# Altium project PROC154E3_SCH.PrjPcb (part 34 of 60)

## Sheet 38. MCU GB ETHERNET.SchDoc: MCU GB ETHERNET
size 513 x 386 mm; Project: PROC154E2(001)_SK_AM69; Issue: 1.0; RevCode: E3; Page Create Date: March  8, 1995; Variant Name: Core Design; Schematic Page Number: 38; Page Number: 38; Page Size: C; Comment: MISTRAL_TITLEBLK_CSIZE_1; Page Count: 62; Schematic Page Count: 62; Name: PROC154E2 001 SK AM69; DsnPath: C:\Users\danie\Downloads\sprr466c\PROC154E3_RP\PROC154E3_SCH.DSN; SchematicName: SCHEMATIC1; PageName: 38. MCU GB ETHERNET; PageSize: C; TopSchematic: True
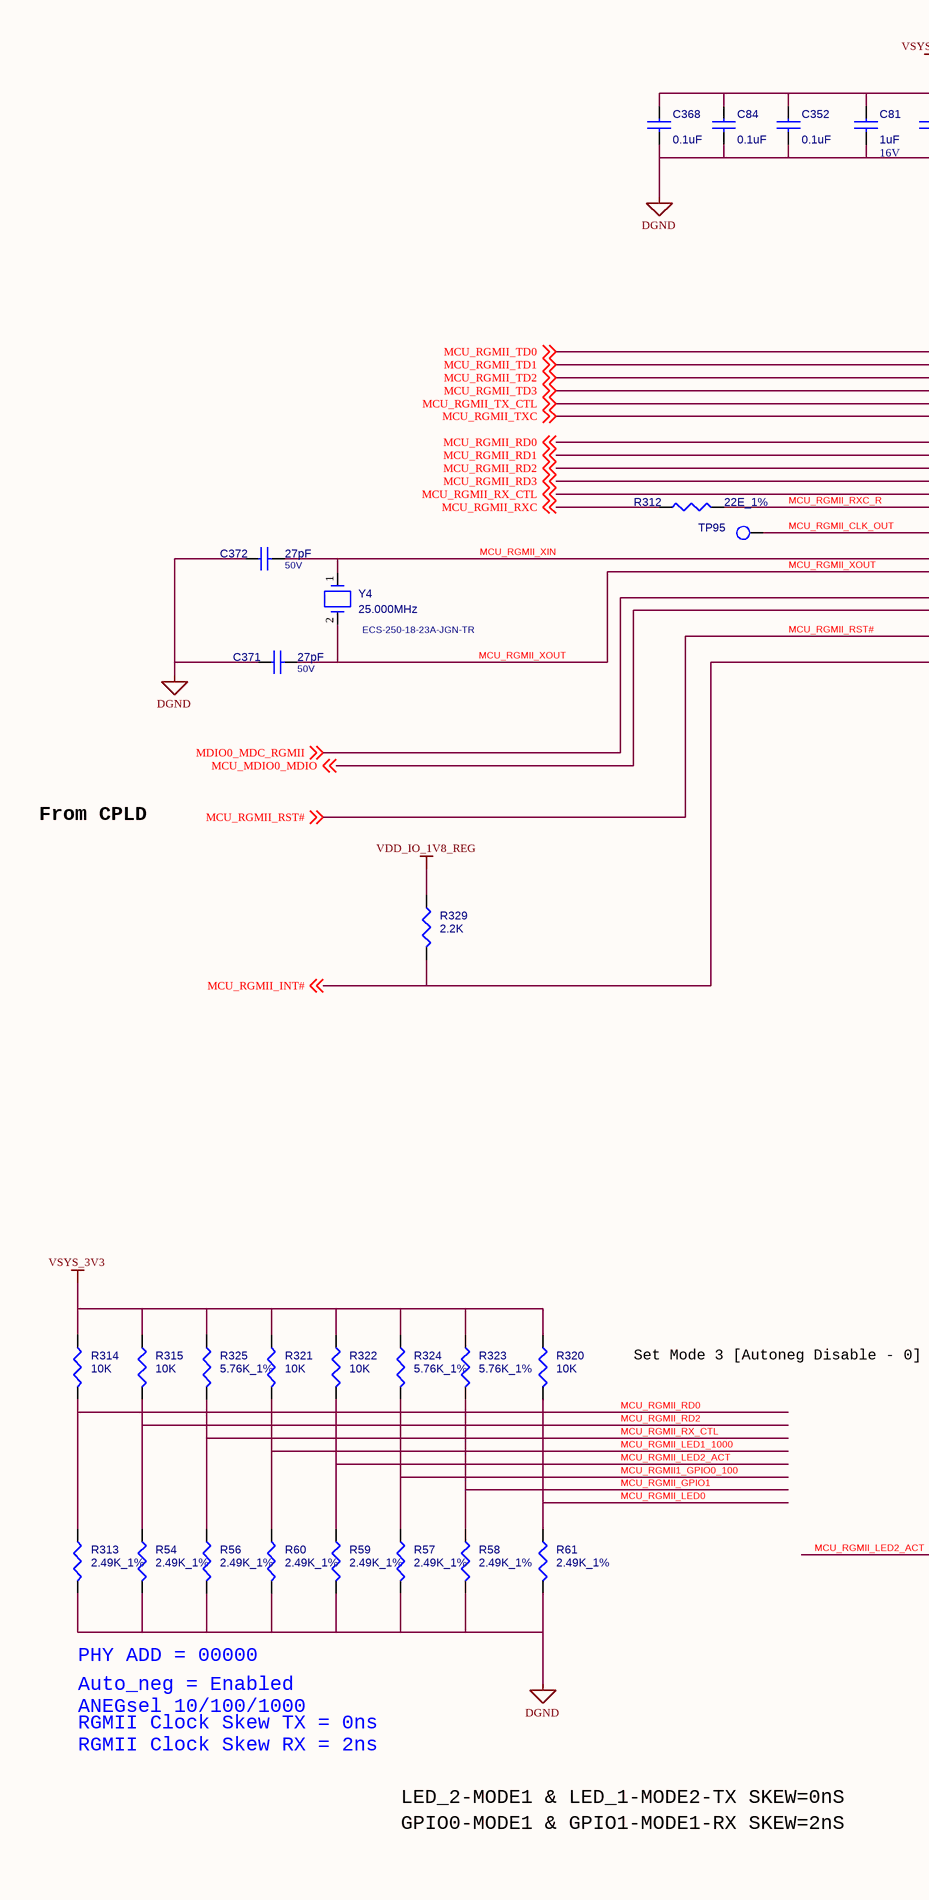
[diagram p62: 38. MCU GB ETHERNET.SchDoc, left]
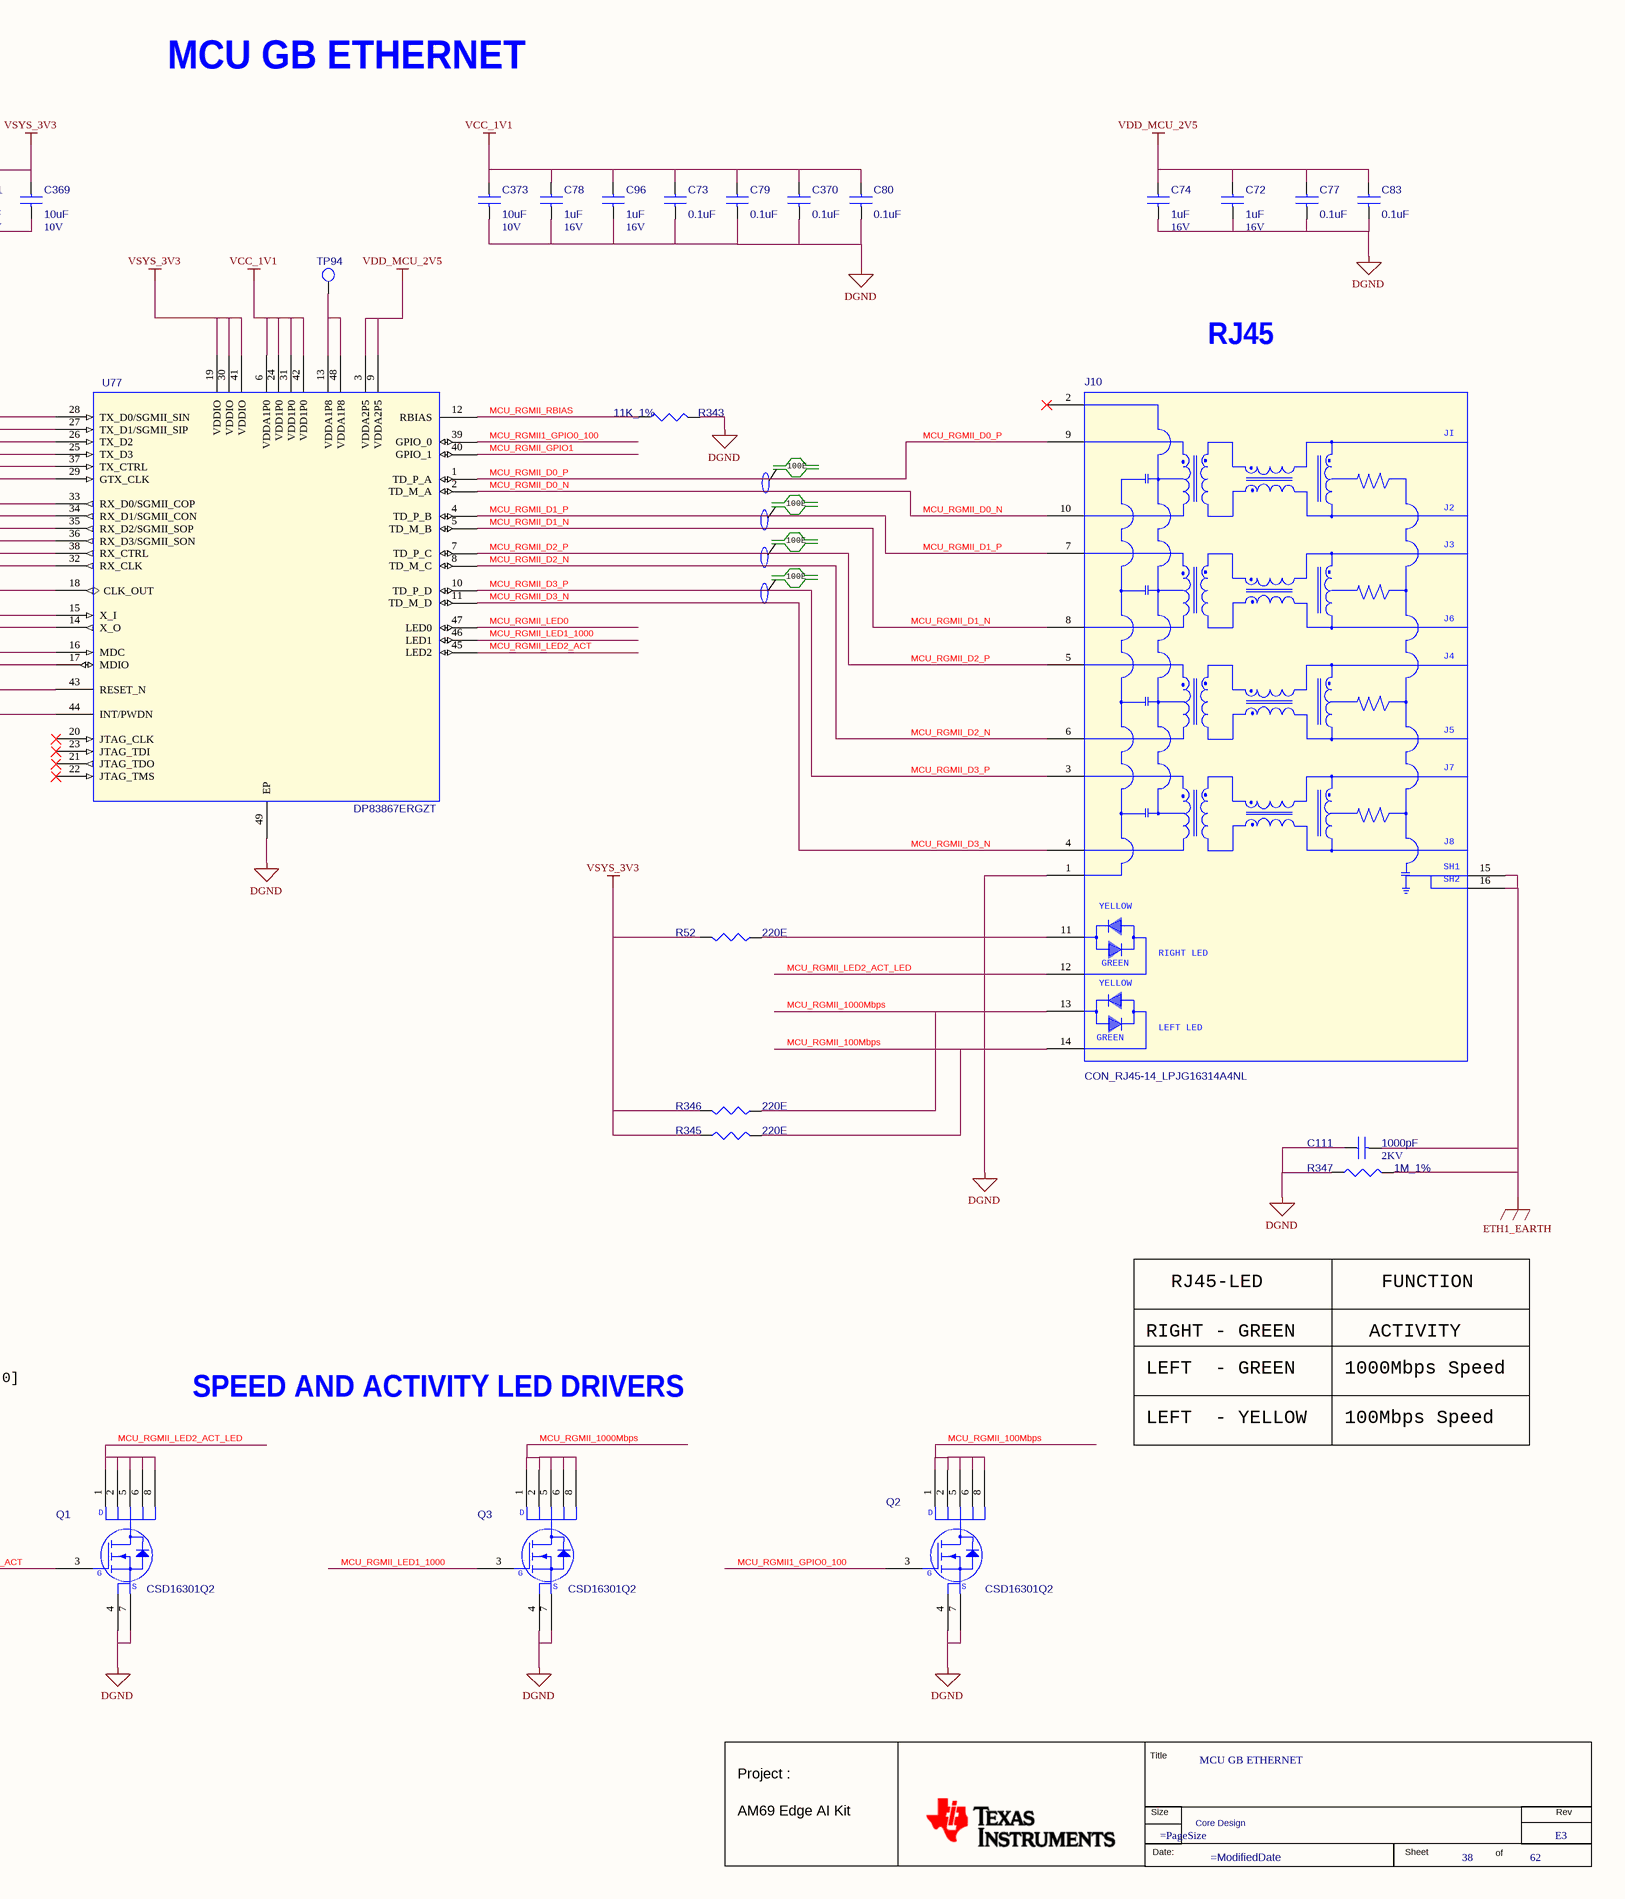
[diagram p63: 38. MCU GB ETHERNET.SchDoc, right]

### Parts
(Parts that share a designator on the sheet are numbered #1, #2 ... from top to bottom, then left to right.)
*#38  RevCode: E3  Title: MCU GB ETHERNET  Page Number: 38  Page Count: 62  Variant Name: Core Design  (hidden comment: MISTRAL_TITLEBLK_CSIZE_1)  (graphical)
C72  1uF  Voltage: 16V  [CAP0201_0-5]
C73  0.1uF  [CAP0201_0-5]
C74  1uF  Voltage: 16V  [CAP0201_0-5]
C77  0.1uF  [CAP0201_0-5]
C78  1uF  Voltage: 16V  [CAP0201_0-5]
C79  0.1uF  [CAP0201_0-5]
C80  0.1uF  [CAP0201_0-5]
C81  1uF  Voltage: 16V  [CAP0201_0-5]
C83  0.1uF  [CAP0201_0-5]
C84  0.1uF  [CAP0201_0-5]
C96  1uF  Voltage: 16V  [CAP0201_0-5]
C111  1000pF  Voltage: 2KV  [CAP1206_1-5]
C352  0.1uF  [CAP0201_0-5]
C368  0.1uF  [CAP0201_0-5]
C369  10uF  Voltage: 10V  [CAP0402_1]
C370  0.1uF  [CAP0201_0-5]
C371  27pF  Voltage: 50V  [CAP0402_0-75]
C372  27pF  Voltage: 50V  [CAP0402_0-75]
C373  10uF  Voltage: 10V  [CAP0402_1]
J10  CON_RJ45-14_LPJG16314A4NL  [CON_RJ45-14_LPJG16314A4NL_S_R_T_13-6]
Q1  CSD16301Q2  [WSON6_CSD13202Q2_80X80_0-8]
Q2  CSD16301Q2  [WSON6_CSD13202Q2_80X80_0-8]
Q3  CSD16301Q2  [WSON6_CSD13202Q2_80X80_0-8]
R52  220E  [RES0402_0-5]
R54  2.49K_1%  [RES0402_0-5]
R56  2.49K_1%  [RES0402_0-5]
R57  2.49K_1%  [RES0402_0-5]
R58  2.49K_1%  [RES0402_0-5]
R59  2.49K_1%  [RES0402_0-5]
R60  2.49K_1%  [RES0402_0-5]
R61  2.49K_1%  [RES0402_0-5]
R312  22E_1%  [RES0402_0-5]
R313  2.49K_1%  [RES0402_0-5]
R314  10K  [RES0402_0-5]
R315  10K  [RES0402_0-5]
R320  10K  [RES0402_0-5]
R321  10K  [RES0402_0-5]
R322  10K  [RES0402_0-5]
R323  5.76K_1%  [RES0402_0-5]
R324  5.76K_1%  [RES0402_0-5]
R325  5.76K_1%  [RES0402_0-5]
R329  2.2K  [RES0201_0-5]
R343  11K_1%  [RES0402_0-5]
R345  220E  [RES0402_0-5]
R346  220E  [RES0402_0-5]
R347  1M_1%  [RES0805_0-75]
TP94  TP30_SMD  [TP30_SMD]  (value not drawn)
TP95  TP30_SMD  [TP30_SMD]  (value not drawn)
U77  DP83867ERGZT  [VQFN48_19-68_285X285]
Y4  25.000MHz  Mfr_part_number: ECS-250-18-23A-JGN-TR  [XTAL_ECX-64A_240X150_SMD_1-1]

### Nets
DGND: C72.2 C73.2 C74.2 C77.2 C78.2 C79.2 C80.2 C81.2 C83.2 C84.2 C96.2 C111.1 C352.2 C368.2 C369.2 C370.2 C371.1 C372.1 C373.2 J10.1(CH-GND) Q1.4(S1) Q1.7(S2) Q2.4(S1) Q2.7(S2) Q3.4(S1) Q3.7(S2) R54.2 R56.2 R57.2 R58.2 R59.2 R60.2 R61.2 R313.2 R343.1 R347.1 U77.49(EP)  [project net VDD_CPU_HCPS_GOSNS]
ETH1_EARTH: C111.2 J10.15(SH1) J10.16(SH2) R347.2
VCC_1V1: C73.1 C78.1 C79.1 C80.1 C96.1 C370.1 C373.1 U77.6(VDDA1P0) U77.24(VDD1P0) U77.31(VDD1P0) U77.42(VDD1P0)
VDD_IO_1V8_REG: R329.1
VDD_MCU_2V5: C72.1 C74.1 C77.1 C83.1 U77.3(VDDA2P5) U77.9(VDDA2P5)
VSYS_3V3: C81.1 C84.1 C352.1 C368.1 C369.1 R52.2 R314.1 R315.1 R320.1 R321.1 R322.1 R323.1 R324.1 R325.1 R345.1 R346.2 U77.19(VDDIO) U77.30(VDDIO) U77.41(VDDIO)  [project net V_3V3]
MCU_MDIO0_MDIO: U77.17(MDIO) ; off-sheet MCU_MDIO0_MDIO
MCU_RGMII1_GPIO0_100: Q2.3(G) R57.1 R324.2 U77.39(GPIO_0)
MCU_RGMII_100Mbps: J10.14 Q2.1(D1) Q2.2(D2) Q2.5(D3) Q2.6(D4) Q2.8(D5) R345.2
MCU_RGMII_1000Mbps: J10.13 Q3.1(D1) Q3.2(D2) Q3.5(D3) Q3.6(D4) Q3.8(D5) R346.1
MCU_RGMII_CLK_OUT: TP95.1(TP) U77.18(CLK_OUT)
MCU_RGMII_D0_N: J10.10(MX0-) U77.2(TD_M_A)
MCU_RGMII_D0_P: J10.9(MX0+) U77.1(TD_P_A)
MCU_RGMII_D1_N: J10.8(MX1-) U77.5(TD_M_B)
MCU_RGMII_D1_P: J10.7(MX1+) U77.4(TD_P_B)
MCU_RGMII_D2_N: J10.6(MX2-) U77.8(TD_M_C)
MCU_RGMII_D2_P: J10.5(MX2+) U77.7(TD_P_C)
MCU_RGMII_D3_N: J10.4(MX3-) U77.11(TD_M_D)
MCU_RGMII_D3_P: J10.3(MX3+) U77.10(TD_P_D)
MCU_RGMII_GPIO1: R58.1 R323.2 U77.40(GPIO_1)
MCU_RGMII_INT#: R329.2 U77.44(INT/PWDN) ; off-sheet MCU_RGMII_INT#
MCU_RGMII_LED0: R61.1 R320.2 U77.47(LED0)
MCU_RGMII_LED1_1000: Q3.3(G) R60.1 R321.2 U77.46(LED1)
MCU_RGMII_LED2_ACT: Q1.3(G) R59.1 R322.2 U77.45(LED2)
MCU_RGMII_LED2_ACT_LED: J10.12 Q1.1(D1) Q1.2(D2) Q1.5(D3) Q1.6(D4) Q1.8(D5)
MCU_RGMII_RBIAS: R343.2 U77.12(RBIAS)
MCU_RGMII_RD0: R313.1 R314.2 U77.33(RX_D0/SGMII_COP) ; off-sheet MCU_RGMII_RD0
MCU_RGMII_RD1: U77.34(RX_D1/SGMII_CON) ; off-sheet MCU_RGMII_RD1
MCU_RGMII_RD2: R54.1 R315.2 U77.35(RX_D2/SGMII_SOP) ; off-sheet MCU_RGMII_RD2
MCU_RGMII_RD3: U77.36(RX_D3/SGMII_SON) ; off-sheet MCU_RGMII_RD3
MCU_RGMII_RST#: U77.43(RESET_N) ; off-sheet MCU_RGMII_RST#
MCU_RGMII_RX_CTL: R56.1 R325.2 U77.38(RX_CTRL) ; off-sheet MCU_RGMII_RX_CTL
MCU_RGMII_RXC: R312.1 ; off-sheet MCU_RGMII_RXC
MCU_RGMII_RXC_R: R312.2 U77.32(RX_CLK)
MCU_RGMII_TD0: U77.28(TX_D0/SGMII_SIN) ; off-sheet MCU_RGMII_TD0
MCU_RGMII_TD1: U77.27(TX_D1/SGMII_SIP) ; off-sheet MCU_RGMII_TD1
MCU_RGMII_TD2: U77.26(TX_D2) ; off-sheet MCU_RGMII_TD2
MCU_RGMII_TD3: U77.25(TX_D3) ; off-sheet MCU_RGMII_TD3
MCU_RGMII_TX_CTL: U77.37(TX_CTRL) ; off-sheet MCU_RGMII_TX_CTL
MCU_RGMII_TXC: U77.29(GTX_CLK) ; off-sheet MCU_RGMII_TXC
MCU_RGMII_XIN: C372.2 U77.15(X_I) Y4.1
MCU_RGMII_XOUT: C371.2 U77.14(X_O) Y4.2
MDIO0_MDC_RGMII: U77.16(MDC) ; off-sheet MDIO0_MDC_RGMII
NetJ10_11: J10.11 R52.1
NetTP94_1: TP94.1(TP) U77.13(VDDA1P8) U77.48(VDDA1P8)

Not connected (* = marked no-connect by the designer): J10 2(VCC)*; U77 20(JTAG_CLK)* 21(JTAG_TDO)* 22(JTAG_TMS)* 23(JTAG_TDI)*

### Notes on the sheet
- MCU GB ETHERNET
- RJ45
- 100E
- From CPLD
- RIGHT - GREEN
- RJ45-LED
- ACTIVITY
- FUNCTION
- Set Mode 3 [Autoneg Disable - 0]
- SPEED AND ACTIVITY LED DRIVERS
- LEFT  - GREEN
- 1000Mbps Speed
- LEFT  - YELLOW
- 100Mbps Speed
- Auto_neg = Enabled
  ANEGsel 10/100/1000
- RGMII Clock Skew TX = 0ns
  RGMII Clock Skew RX = 2ns
- PHY ADD = 00000
- GPIO0-MODE1 & GPIO1-MODE1-RX SKEW=2nS
- LED_2-MODE1 & LED_1-MODE2-TX SKEW=0nS
- (in symbol CON_RJ45-14_LPJG16314A4NL) JI; J2; J3; J6; J4; J5; J7; J8; YELLOW; RIGHT LED; GREEN; LEFT LED
- (in symbol MISTRAL_TITLEBLK_CSIZE_1) Title; Project :; Size; Rev; AM69 Edge AI Kit; Date:; Sheet; of
- (in symbol MOSFET_CSD17313Q2) D; S

### Library data of the parts
*#38 = MISTRAL_TITLEBLK_CSIZE_1: Issue: 1.0; Project: PROC154E2(001)_SK_AM69; Name: PROC154E2 001 SK AM69; Page Create Date: March  8, 1995; Page Size: =PageSize; Page Modify Date: =ModifiedDate; Schematic Page Count: 62; Schematic Page Number: 38
C72 = CAP_Dup1: CAP CERAMIC 1uF 16V 20% X5R 0201; Part Reference: C72; Part_type: CAPACITORS\CERAMIC; Mfr_part_number: CL03A105MO3NRNH; Mfr_name: SAMSUNG; Mistral Part No: 120018090038-R; Custom_Duty: 15%; Customs_HS_Code: 85322990; Wattage: NA; Project: TI_60GHz-AOP; Value: 1uF; PCB Footprint: CAP0201_0-5; Footprint Path: Y:\MIS_DATABASE\Library\ALTIUM_TOOL\PCB_FOOTPRINTS\Altium_Footprint_Lib.PcbLib; Library Path: Y:\MIS_DATABASE\Library\ALTIUM_TOOL\SCHEMATICS_PARTS\MS_DISCRETE_Library.schlib; Footprint Ref: CAP0201_0-5; Chkd/date: MANIRAJA/220918; Crtd /date: MANIRAJA/220918; Datasheet: Y:\MIS_DATABASE\DATASHEETS\CAPACITORS\CL03A105MO3NRNH.PDF; Temperature: -55°C+85°C; Weight: 0.17mg; Height: 0.39MM; Distributor_part_number: 1276-6798-1-ND; Distributor_name: DIGIKEY; Package: 0201; Tolerance: 20%; Library Ref: CAP; MECHANICAL 3D STEP FILE: CAP0201_0-5
C73 = CAP_Dup1: CAP CERAMIC 0.1uF 16V 10% X7S AUTO 0201; Part Reference: C73; Mistral Part No: 120021030007-R; Mfr_name: MURATA; Mfr_part_number: GRT033C71C104KE01D; Part_type: CAPACITORS\CERAMIC; Project: J7ES_SK_BRD; Wattage: NA; Customs_HS_Code: 85322990; Custom_Duty: 15%; Value: 0.1uF; PCB Footprint: CAP0201_0-5; Tolerance: 10%; Voltage: 16V; Package: 0201; Distributor_name: DIGIKEY; Distributor_part_number: 490-GRT033C71C104KE01DTR-ND; Height: 0.33MM; Weight: 330mg; Temperature: -55°C+125°C; Datasheet: Y:\MIS_DATABASE\DATASHEETS\CAPACITORS\GRT033C71C104KE01.PDF; Crtd /date: ALVY/110321; Chkd/date: MANIRAJA/110321; MECHANICAL 3D STEP FILE: CAP0201_0-5
C74 = CAP_Dup1: CAP CERAMIC 1uF 16V 20% X5R 0201; Part Reference: C74; Part_type: CAPACITORS\CERAMIC; Mfr_part_number: CL03A105MO3NRNH; Mfr_name: SAMSUNG; Mistral Part No: 120018090038-R; Custom_Duty: 15%; Customs_HS_Code: 85322990; Wattage: NA; Project: TI_60GHz-AOP; Value: 1uF; PCB Footprint: CAP0201_0-5; Footprint Path: Y:\MIS_DATABASE\Library\ALTIUM_TOOL\PCB_FOOTPRINTS\Altium_Footprint_Lib.PcbLib; Library Path: Y:\MIS_DATABASE\Library\ALTIUM_TOOL\SCHEMATICS_PARTS\MS_DISCRETE_Library.schlib; Footprint Ref: CAP0201_0-5; Chkd/date: MANIRAJA/220918; Crtd /date: MANIRAJA/220918; Datasheet: Y:\MIS_DATABASE\DATASHEETS\CAPACITORS\CL03A105MO3NRNH.PDF; Temperature: -55°C+85°C; Weight: 0.17mg; Height: 0.39MM; Distributor_part_number: 1276-6798-1-ND; Distributor_name: DIGIKEY; Package: 0201; Tolerance: 20%; Library Ref: CAP; MECHANICAL 3D STEP FILE: CAP0201_0-5
C77 = CAP_Dup1: CAP CERAMIC 0.1uF 16V 10% X7S AUTO 0201; Part Reference: C77; Part_type: CAPACITORS\CERAMIC; Mfr_part_number: GRT033C71C104KE01D; Mfr_name: MURATA; Mistral Part No: 120021030007-R; Custom_Duty: 15%; Customs_HS_Code: 85322990; Wattage: NA; Project: J7ES_SK_BRD; Value: 0.1uF; PCB Footprint: CAP0201_0-5; MECHANICAL 3D STEP FILE: CAP0201_0-5; Chkd/date: MANIRAJA/110321; Crtd /date: ALVY/110321; Datasheet: Y:\MIS_DATABASE\DATASHEETS\CAPACITORS\GRT033C71C104KE01.PDF; Temperature: -55°C+125°C; Weight: 330mg; Height: 0.33MM; Distributor_part_number: 490-GRT033C71C104KE01DTR-ND; Distributor_name: DIGIKEY; Package: 0201; Voltage: 16V; Tolerance: 10%
C78 = CAP_Dup1: CAP CERAMIC 1uF 16V 20% X5R 0201; Part Reference: C78; Part_type: CAPACITORS\CERAMIC; Mfr_part_number: CL03A105MO3NRNH; Mfr_name: SAMSUNG; Mistral Part No: 120018090038-R; Custom_Duty: 15%; Customs_HS_Code: 85322990; Wattage: NA; Project: TI_60GHz-AOP; Value: 1uF; PCB Footprint: CAP0201_0-5; Footprint Path: Y:\MIS_DATABASE\Library\ALTIUM_TOOL\PCB_FOOTPRINTS\Altium_Footprint_Lib.PcbLib; Library Path: Y:\MIS_DATABASE\Library\ALTIUM_TOOL\SCHEMATICS_PARTS\MS_DISCRETE_Library.schlib; Footprint Ref: CAP0201_0-5; Chkd/date: MANIRAJA/220918; Crtd /date: MANIRAJA/220918; Datasheet: Y:\MIS_DATABASE\DATASHEETS\CAPACITORS\CL03A105MO3NRNH.PDF; Temperature: -55°C+85°C; Weight: 0.17mg; Height: 0.39MM; Distributor_part_number: 1276-6798-1-ND; Distributor_name: DIGIKEY; Package: 0201; Tolerance: 20%; Library Ref: CAP; MECHANICAL 3D STEP FILE: CAP0201_0-5
C79 = CAP_Dup1: CAP CERAMIC 0.1uF 16V 10% X7S AUTO 0201; Part Reference: C79; Mistral Part No: 120021030007-R; Mfr_name: MURATA; Mfr_part_number: GRT033C71C104KE01D; Part_type: CAPACITORS\CERAMIC; Project: J7ES_SK_BRD; Wattage: NA; Customs_HS_Code: 85322990; Custom_Duty: 15%; Value: 0.1uF; PCB Footprint: CAP0201_0-5; Tolerance: 10%; Voltage: 16V; Package: 0201; Distributor_name: DIGIKEY; Distributor_part_number: 490-GRT033C71C104KE01DTR-ND; Height: 0.33MM; Weight: 330mg; Temperature: -55°C+125°C; Datasheet: Y:\MIS_DATABASE\DATASHEETS\CAPACITORS\GRT033C71C104KE01.PDF; Crtd /date: ALVY/110321; Chkd/date: MANIRAJA/110321; MECHANICAL 3D STEP FILE: CAP0201_0-5
C80 = CAP_Dup1: CAP CERAMIC 0.1uF 16V 10% X7S AUTO 0201; Part Reference: C80; Part_type: CAPACITORS\CERAMIC; Mfr_part_number: GRT033C71C104KE01D; Mfr_name: MURATA; Mistral Part No: 120021030007-R; Custom_Duty: 15%; Customs_HS_Code: 85322990; Wattage: NA; Project: J7ES_SK_BRD; Value: 0.1uF; PCB Footprint: CAP0201_0-5; MECHANICAL 3D STEP FILE: CAP0201_0-5; Chkd/date: MANIRAJA/110321; Crtd /date: ALVY/110321; Datasheet: Y:\MIS_DATABASE\DATASHEETS\CAPACITORS\GRT033C71C104KE01.PDF; Temperature: -55°C+125°C; Weight: 330mg; Height: 0.33MM; Distributor_part_number: 490-GRT033C71C104KE01DTR-ND; Distributor_name: DIGIKEY; Package: 0201; Voltage: 16V; Tolerance: 10%
C81 = CAP_Dup1: CAP CERAMIC 1uF 16V 20% X5R 0201; Part Reference: C81; Mistral Part No: 120018090038-R; Mfr_name: SAMSUNG; Mfr_part_number: CL03A105MO3NRNH; Part_type: CAPACITORS\CERAMIC; Project: TI_60GHz-AOP; Wattage: NA; Customs_HS_Code: 85322990; Custom_Duty: 15%; Value: 1uF; PCB Footprint: CAP0201_0-5; Footprint Path: Y:\MIS_DATABASE\Library\ALTIUM_TOOL\PCB_FOOTPRINTS\Altium_Footprint_Lib.PcbLib; Library Path: Y:\MIS_DATABASE\Library\ALTIUM_TOOL\SCHEMATICS_PARTS\MS_DISCRETE_Library.schlib; Footprint Ref: CAP0201_0-5; Tolerance: 20%; Package: 0201; Distributor_name: DIGIKEY; Distributor_part_number: 1276-6798-1-ND; Height: 0.39MM; Weight: 0.17mg; Temperature: -55°C+85°C; Datasheet: Y:\MIS_DATABASE\DATASHEETS\CAPACITORS\CL03A105MO3NRNH.PDF; Crtd /date: MANIRAJA/220918; Chkd/date: MANIRAJA/220918; Library Ref: CAP; MECHANICAL 3D STEP FILE: CAP0201_0-5
C83 = CAP_Dup1: CAP CERAMIC 0.1uF 16V 10% X7S AUTO 0201; Part Reference: C83; Part_type: CAPACITORS\CERAMIC; Mfr_part_number: GRT033C71C104KE01D; Mfr_name: MURATA; Mistral Part No: 120021030007-R; Custom_Duty: 15%; Customs_HS_Code: 85322990; Wattage: NA; Project: J7ES_SK_BRD; Value: 0.1uF; PCB Footprint: CAP0201_0-5; MECHANICAL 3D STEP FILE: CAP0201_0-5; Chkd/date: MANIRAJA/110321; Crtd /date: ALVY/110321; Datasheet: Y:\MIS_DATABASE\DATASHEETS\CAPACITORS\GRT033C71C104KE01.PDF; Temperature: -55°C+125°C; Weight: 330mg; Height: 0.33MM; Distributor_part_number: 490-GRT033C71C104KE01DTR-ND; Distributor_name: DIGIKEY; Package: 0201; Voltage: 16V; Tolerance: 10%
C84 = CAP_Dup1: CAP CERAMIC 0.1uF 16V 10% X7S AUTO 0201; Part Reference: C84; Part_type: CAPACITORS\CERAMIC; Mfr_part_number: GRT033C71C104KE01D; Mfr_name: MURATA; Mistral Part No: 120021030007-R; Custom_Duty: 15%; Customs_HS_Code: 85322990; Wattage: NA; Project: J7ES_SK_BRD; Value: 0.1uF; PCB Footprint: CAP0201_0-5; MECHANICAL 3D STEP FILE: CAP0201_0-5; Chkd/date: MANIRAJA/110321; Crtd /date: ALVY/110321; Datasheet: Y:\MIS_DATABASE\DATASHEETS\CAPACITORS\GRT033C71C104KE01.PDF; Temperature: -55°C+125°C; Weight: 330mg; Height: 0.33MM; Distributor_part_number: 490-GRT033C71C104KE01DTR-ND; Distributor_name: DIGIKEY; Package: 0201; Voltage: 16V; Tolerance: 10%
C96 = CAP_Dup1: CAP CERAMIC 1uF 16V 20% X5R 0201; Part Reference: C96; Mistral Part No: 120018090038-R; Mfr_name: SAMSUNG; Mfr_part_number: CL03A105MO3NRNH; Part_type: CAPACITORS\CERAMIC; Project: TI_60GHz-AOP; Wattage: NA; Customs_HS_Code: 85322990; Custom_Duty: 15%; Value: 1uF; PCB Footprint: CAP0201_0-5; Footprint Path: Y:\MIS_DATABASE\Library\ALTIUM_TOOL\PCB_FOOTPRINTS\Altium_Footprint_Lib.PcbLib; Library Path: Y:\MIS_DATABASE\Library\ALTIUM_TOOL\SCHEMATICS_PARTS\MS_DISCRETE_Library.schlib; Footprint Ref: CAP0201_0-5; Tolerance: 20%; Package: 0201; Distributor_name: DIGIKEY; Distributor_part_number: 1276-6798-1-ND; Height: 0.39MM; Weight: 0.17mg; Temperature: -55°C+85°C; Datasheet: Y:\MIS_DATABASE\DATASHEETS\CAPACITORS\CL03A105MO3NRNH.PDF; Crtd /date: MANIRAJA/220918; Chkd/date: MANIRAJA/220918; Library Ref: CAP; MECHANICAL 3D STEP FILE: CAP0201_0-5
C111 = CAP_Dup1: CAP CERAMIC 1000pF 2KV 10% X7R 1206; Part Reference: C111; Automotive Alternate_mfr_part_number: C1206X102KGRACAUTO; Automotive Alternate_mfr_name: KEMET; Direct Alternate_mfr_part_number: C1206C102KGRACTU; Mistral Part No: 120015110005-R; Part_type: CAPACITORS\CERAMIC; Project: MANTIS_1.0_BRD; Customs_HS_Code: 85322990; Custom_Duty: 15%; Wattage: NA; Value: 1000pF; PCB Footprint: CAP1206_1-5; Direct Alternate_mfr_name: KEMET; Footprint Path: Y:\MIS_DATABASE\Library\ALTIUM_TOOL\PCB_FOOTPRINTS\Altium_Footprint_Lib.PcbLib; Library Path: Y:\MIS_DATABASE\Library\ALTIUM_TOOL\SCHEMATICS_PARTS\MS_DISCRETE_Library.schlib; Footprint Ref: CAP1206_1-5; Library Ref: CAP; Mfr_name: KEMET; Mfr_part_number: C1206C102KGRACTU; Tolerance: 10%; Package: 1206; Distributor_name: DIGIKEY; Distributor_part_number: 399-4819-1-ND; Height: 1.35MM; Weight: 16.2mg; Temperature: -55°C+125°C; Datasheet: Y:\MIS_DATABASE\DATASHEETS\CAPACITORS\KEMET-C-X7R-HV.PDF; Crtd /date: ALVY/111219; Chkd/date: MANIRAJA/111219; MECHANICAL 3D STEP FILE: CAP1206_1-5
C352 = CAP_Dup1: CAP CERAMIC 0.1uF 16V 10% X7S AUTO 0201; Part Reference: C352; Part_type: CAPACITORS\CERAMIC; Mfr_part_number: GRT033C71C104KE01D; Mfr_name: MURATA; Mistral Part No: 120021030007-R; Custom_Duty: 15%; Customs_HS_Code: 85322990; Wattage: NA; Project: J7ES_SK_BRD; Value: 0.1uF; PCB Footprint: CAP0201_0-5; MECHANICAL 3D STEP FILE: CAP0201_0-5; Chkd/date: MANIRAJA/110321; Crtd /date: ALVY/110321; Datasheet: Y:\MIS_DATABASE\DATASHEETS\CAPACITORS\GRT033C71C104KE01.PDF; Temperature: -55°C+125°C; Weight: 330mg; Height: 0.33MM; Distributor_part_number: 490-GRT033C71C104KE01DTR-ND; Distributor_name: DIGIKEY; Package: 0201; Voltage: 16V; Tolerance: 10%
C368 = CAP_Dup1: CAP CERAMIC 0.1uF 16V 10% X7S AUTO 0201; Part Reference: C368; Mistral Part No: 120021030007-R; Mfr_name: MURATA; Mfr_part_number: GRT033C71C104KE01D; Part_type: CAPACITORS\CERAMIC; Project: J7ES_SK_BRD; Wattage: NA; Customs_HS_Code: 85322990; Custom_Duty: 15%; Value: 0.1uF; PCB Footprint: CAP0201_0-5; Tolerance: 10%; Voltage: 16V; Package: 0201; Distributor_name: DIGIKEY; Distributor_part_number: 490-GRT033C71C104KE01DTR-ND; Height: 0.33MM; Weight: 330mg; Temperature: -55°C+125°C; Datasheet: Y:\MIS_DATABASE\DATASHEETS\CAPACITORS\GRT033C71C104KE01.PDF; Crtd /date: ALVY/110321; Chkd/date: MANIRAJA/110321; MECHANICAL 3D STEP FILE: CAP0201_0-5
C369 = CAP_Dup1: CAP CERAMIC 10uF 10V 20% X5R 0402; Part Reference: C369; Part_type: CAPACITORS\CERAMIC; Mfr_part_number: CL05A106MP8NUB8; Mfr_name: SAMSUNG; Mistral Part No: 120019020008-R; Wattage: NA; Custom_Duty: 15%; Customs_HS_Code: 85322990; Project: TI_60GHz-AOP; Value: 10uF; PCB Footprint: CAP0402_1; Footprint Path: Y:\MIS_DATABASE\Library\ALTIUM_TOOL\PCB_FOOTPRINTS\Altium_Footprint_Lib.PcbLib; Library Path: Y:\MIS_DATABASE\Library\ALTIUM_TOOL\SCHEMATICS_PARTS\MS_DISCRETE_Library.schlib; MECHANICAL 3D STEP FILE: CAP0402_1; Temperature: -55°C+85°C; Weight: NA; Footprint Ref: CAP0402_1; Chkd/date: MANIRAJA/150219; Crtd /date: ALVY/150219; Datasheet: Y:\MIS_DATABASE\DATASHEETS\CAPACITORS\CL05A106MP8NUB8.PDF; Height: 0.90MM; Distributor_part_number: 1276-6830-1-ND; Distributor_name: DIGIKEY; Package: 0402; Tolerance: 20%; Library Ref: CAP
C370 = CAP_Dup1: CAP CERAMIC 0.1uF 16V 10% X7S AUTO 0201; Part Reference: C370; Part_type: CAPACITORS\CERAMIC; Mfr_part_number: GRT033C71C104KE01D; Mfr_name: MURATA; Mistral Part No: 120021030007-R; Custom_Duty: 15%; Customs_HS_Code: 85322990; Wattage: NA; Project: J7ES_SK_BRD; Value: 0.1uF; PCB Footprint: CAP0201_0-5; MECHANICAL 3D STEP FILE: CAP0201_0-5; Chkd/date: MANIRAJA/110321; Crtd /date: ALVY/110321; Datasheet: Y:\MIS_DATABASE\DATASHEETS\CAPACITORS\GRT033C71C104KE01.PDF; Temperature: -55°C+125°C; Weight: 330mg; Height: 0.33MM; Distributor_part_number: 490-GRT033C71C104KE01DTR-ND; Distributor_name: DIGIKEY; Package: 0201; Voltage: 16V; Tolerance: 10%
C371 = CAP_Dup1: CAP CERAMIC 27pF 50V 5% C0G(NP0) AUTO 0402; Part Reference: C371; Mistral Part No: 120019040040-R; Mfr_name: MURATA; Mfr_part_number: GCM1555C1H270JA16D; Part_type: CAPACITORS\CERAMIC; Direct Alternate_mfr_name: SAMSUNG; Direct Alternate_mfr_part_number: CL05C270JB5NNNC; Automotive Alternate_mfr_name: TDK; Automotive Alternate_mfr_part_number: CGA2B2C0G1H270J050BA; Wattage: NA; Project: RSAPR_TYPE-II_DIO; Customs_HS_Code: 85322990; Custom_Duty: 15%; Value: 27pF; PCB Footprint: CAP0402_0-75; Footprint Path: Y:\MIS_DATABASE\Library\ALTIUM_TOOL\PCB_FOOTPRINTS\Altium_Footprint_Lib.PcbLib; Library Path: Y:\MIS_DATABASE\Library\ALTIUM_TOOL\SCHEMATICS_PARTS\MS_DISCRETE_Library.schlib; MECHANICAL 3D STEP FILE: CAP0402_0-75; Temperature: -55°C+125°C; Weight: 6mg; Footprint Ref: CAP0402_0-75; Library Ref: CAP; Tolerance: 5%; Package: 0402; Distributor_name: DIGIKEY; Distributor_part_number: 490-12651-1-ND; Height: 0.55MM; Datasheet: Y:\MIS_DATABASE\DATASHEETS\CAPACITORS\MURATA-GCM-SER.PDF; Crtd /date: ALVY/260218; Chkd/date: MANIRAJA/270218
C372 = CAP_Dup1: CAP CERAMIC 27pF 50V 5% C0G(NP0) AUTO 0402; Part Reference: C372; Automotive Alternate_mfr_part_number: CGA2B2C0G1H270J050BA; Automotive Alternate_mfr_name: TDK; Direct Alternate_mfr_part_number: CL05C270JB5NNNC; Direct Alternate_mfr_name: SAMSUNG; Part_type: CAPACITORS\CERAMIC; Mfr_part_number: GCM1555C1H270JA16D; Mfr_name: MURATA; Mistral Part No: 120019040040-R; Custom_Duty: 15%; Customs_HS_Code: 85322990; Project: RSAPR_TYPE-II_DIO; Wattage: NA; Value: 27pF; PCB Footprint: CAP0402_0-75; Chkd/date: MANIRAJA/270218; Crtd /date: ALVY/260218; Datasheet: Y:\MIS_DATABASE\DATASHEETS\CAPACITORS\MURATA-GCM-SER.PDF; Height: 0.55MM; Distributor_part_number: 490-12651-1-ND; Distributor_name: DIGIKEY; Package: 0402; Tolerance: 5%; Library Ref: CAP; Footprint Ref: CAP0402_0-75; Weight: 6mg; Temperature: -55°C+125°C; MECHANICAL 3D STEP FILE: CAP0402_0-75; Library Path: Y:\MIS_DATABASE\Library\ALTIUM_TOOL\SCHEMATICS_PARTS\MS_DISCRETE_Library.schlib; Footprint Path: Y:\MIS_DATABASE\Library\ALTIUM_TOOL\PCB_FOOTPRINTS\Altium_Footprint_Lib.PcbLib
C373 = CAP_Dup1: CAP CERAMIC 10uF 10V 20% X5R 0402; Part Reference: C373; Mistral Part No: 120019020008-R; Mfr_name: SAMSUNG; Mfr_part_number: CL05A106MP8NUB8; Part_type: CAPACITORS\CERAMIC; Wattage: NA; Project: TI_60GHz-AOP; Customs_HS_Code: 85322990; Custom_Duty: 15%; Value: 10uF; PCB Footprint: CAP0402_1; Footprint Path: Y:\MIS_DATABASE\Library\ALTIUM_TOOL\PCB_FOOTPRINTS\Altium_Footprint_Lib.PcbLib; Library Path: Y:\MIS_DATABASE\Library\ALTIUM_TOOL\SCHEMATICS_PARTS\MS_DISCRETE_Library.schlib; MECHANICAL 3D STEP FILE: CAP0402_1; Temperature: -55°C+85°C; Weight: NA; Footprint Ref: CAP0402_1; Library Ref: CAP; Tolerance: 20%; Package: 0402; Distributor_name: DIGIKEY; Distributor_part_number: 1276-6830-1-ND; Height: 0.90MM; Datasheet: Y:\MIS_DATABASE\DATASHEETS\CAPACITORS\CL05A106MP8NUB8.PDF; Crtd /date: ALVY/150219; Chkd/date: MANIRAJA/150219
J10 = CON_RJ45-14_LPJG16314A4NL: CON RJ-45 FEMALE 14POS RT TH; Part Reference: J10; Mistral Part No: 150014060029-R; Mfr_name: LINK-PP; Part_type: CONNECTOR\JACK; Project: AEGIS; Tolerance: NA; Customs_HS_Code: 85369090; Custom_Duty: 24%; Value: CON_RJ45-14_LPJG16314A4NL; PCB Footprint: CON_RJ45-14_LPJG16314A4NL_S_R_T_13-6; Footprint Ref: CON_RJ45-14_LPJG16314A4NL_S_R_T_13-6; Mfr_part_number: LPJG16314A4NL; Voltage: NA; Wattage: NA; Package: THRU-HOLE; Distributor_name: NA; Distributor_part_number: NA; Library Ref: CON_RJ45-14_LPJG16314A4NL; Height: 13.60MM; Weight: NA; Temperature: -0°C+70°C; Datasheet: Y:\MIS_DATABASE\DATASHEETS\CONNECTORS\LPJG16314A4NL.PDF; Crtd /date: BALACHANDAR/120614; Chkd/date: VASANTHA/150714; MECHANICAL 3D STEP FILE: CON_RJ45-14_LPJG16314A4NL_S_R_T_13-6; Library Path: Y:\MIS_DATABASE\Library\ALTIUM_TOOL\SCHEMATICS_PARTS\MS_CONNECTOR_Library.schlib; Footprint Path: Y:\MIS_DATABASE\Library\ALTIUM_TOOL\PCB_FOOTPRINTS\Altium_Footprint_Lib.PcbLib
Q1 = MOSFET_CSD17313Q2: IC MOSFET N-CHANNEL NEXFET 25V WSON6; Part Reference: Q1; Part_type: ICS\POWER\MOSFET; Mfr_name: TEXAS INSTRUMENTS; Mistral Part No: 142020120008-R; Custom_Duty: 15%; Customs_HS_Code: 85423100; Wattage: NA; Project: TI_AM243x LP EVM; Value: CSD16301Q2; PCB Footprint: WSON6_CSD13202Q2_80X80_0-8; Footprint Path: Y:\MIS_DATABASE\Library\ALTIUM_TOOL\PCB_FOOTPRINTS\Altium_Footprint_Lib.PcbLib; Library Path: Y:\MIS_DATABASE\Library\ALTIUM_TOOL\SCHEMATICS_PARTS\MS_MOSFET_Library.schlib; MECHANICAL 3D STEP FILE: WSON6_CSD13202Q2_80X80_0-8; Chkd/date: ALVY/071220; Crtd /date: MANIRAJA/071220; Datasheet: Y:\MIS_DATABASE\DATASHEETS\ICS\POWER\CSD16301Q2.PDF; Temperature: -55°C+150°C; Weight: 8.7mg; Height: 0.80MM; Library Ref: MOSFET_CSD17313Q2; Distributor_part_number: 296-25260-1-ND; Distributor_name: DIGIKEY; Package: WSON6; Voltage: NA; Tolerance: NA; Mfr_part_number: CSD16301Q2; Footprint Ref: WSON6_CSD13202Q2_80X80_0-8
Q2 = MOSFET_CSD17313Q2: IC MOSFET N-CHANNEL NEXFET 25V WSON6; Part Reference: Q2; Part_type: ICS\POWER\MOSFET; Mfr_name: TEXAS INSTRUMENTS; Mistral Part No: 142020120008-R; Custom_Duty: 15%; Customs_HS_Code: 85423100; Wattage: NA; Project: TI_AM243x LP EVM; Value: CSD16301Q2; PCB Footprint: WSON6_CSD13202Q2_80X80_0-8; Footprint Path: Y:\MIS_DATABASE\Library\ALTIUM_TOOL\PCB_FOOTPRINTS\Altium_Footprint_Lib.PcbLib; Library Path: Y:\MIS_DATABASE\Library\ALTIUM_TOOL\SCHEMATICS_PARTS\MS_MOSFET_Library.schlib; MECHANICAL 3D STEP FILE: WSON6_CSD13202Q2_80X80_0-8; Chkd/date: ALVY/071220; Crtd /date: MANIRAJA/071220; Datasheet: Y:\MIS_DATABASE\DATASHEETS\ICS\POWER\CSD16301Q2.PDF; Temperature: -55°C+150°C; Weight: 8.7mg; Height: 0.80MM; Library Ref: MOSFET_CSD17313Q2; Distributor_part_number: 296-25260-1-ND; Distributor_name: DIGIKEY; Package: WSON6; Voltage: NA; Tolerance: NA; Mfr_part_number: CSD16301Q2; Footprint Ref: WSON6_CSD13202Q2_80X80_0-8
Q3 = MOSFET_CSD17313Q2: IC MOSFET N-CHANNEL NEXFET 25V WSON6; Part Reference: Q3; Mistral Part No: 142020120008-R; Mfr_name: TEXAS INSTRUMENTS; Part_type: ICS\POWER\MOSFET; Project: TI_AM243x LP EVM; Tolerance: NA; Customs_HS_Code: 85423100; Custom_Duty: 15%; Value: CSD16301Q2; PCB Footprint: WSON6_CSD13202Q2_80X80_0-8; Footprint Ref: WSON6_CSD13202Q2_80X80_0-8; Mfr_part_number: CSD16301Q2; Voltage: NA; Wattage: NA; Package: WSON6; Distributor_name: DIGIKEY; Distributor_part_number: 296-25260-1-ND; Library Ref: MOSFET_CSD17313Q2; Height: 0.80MM; Weight: 8.7mg; Temperature: -55°C+150°C; Datasheet: Y:\MIS_DATABASE\DATASHEETS\ICS\POWER\CSD16301Q2.PDF; Crtd /date: MANIRAJA/071220; Chkd/date: ALVY/071220; MECHANICAL 3D STEP FILE: WSON6_CSD13202Q2_80X80_0-8; Library Path: Y:\MIS_DATABASE\Library\ALTIUM_TOOL\SCHEMATICS_PARTS\MS_MOSFET_Library.schlib; Footprint Path: Y:\MIS_DATABASE\Library\ALTIUM_TOOL\PCB_FOOTPRINTS\Altium_Footprint_Lib.PcbLib
R52 = RESISTOR_Dup2: RES 220E 1/16W 5% 0402; Part Reference: R52; Mistral Part No: 110020120013-R; Mfr_name: YAGEO AMERICA; Mfr_part_number: RC0402JR-07220RL; Part_type: RESISTORS\FIXED; Project: TI_AM243x LP EVM; Voltage: NA; Customs_HS_Code: 85332119; Custom_Duty: 15%; Value: 220E; PCB Footprint: RES0402_0-5; Footprint Path: Y:\MIS_DATABASE\Library\ALTIUM_TOOL\PCB_FOOTPRINTS\Altium_Footprint_Lib.PcbLib; Library Path: Y:\MIS_DATABASE\Library\ALTIUM_TOOL\SCHEMATICS_PARTS\MS_DISCRETE_Library.schlib; Footprint Ref: RES0402_0-5; Library Ref: RESISTOR; Tolerance: 5%; Wattage: 1/16W; Package: 0402; Distributor_name: DIGIKEY; Distributor_part_number: 311-220JRCT-ND; Height: 0.40MM; Weight: 0.65mg; Temperature: -55°C+155°C; Datasheet: Y:\MIS_DATABASE\DATASHEETS\RESISTORS\RCXXXXL-SER_MAR18.PDF; Crtd /date: MANIRAJA/091220; Chkd/date: ALVY/091220; MECHANICAL 3D STEP FILE: RES0402_0-5
R54 = RESISTOR_Dup2: RES 2.49K 1/16W 1% 0402; Part Reference: R54; Mistral Part No: 110016050020-R; Mfr_name: YAGEO AMERICA; Mfr_part_number: RC0402FR-072K49L; Part_type: RESISTORS\FIXED; Project: TMDXCSKCC; Voltage: NA; Customs_HS_Code: 85332119; Custom_Duty: 15%; Value: 2.49K_1%; PCB Footprint: RES0402_0-5; Tolerance: 1%; Wattage: 1/16W; Package: 0402; Distributor_name: DIGIKEY; Distributor_part_number: 311-2.49KLRCT-ND; Height: 0.40MM; Weight: 0.65mg; Temperature: -55°C+155°C; Datasheet: Y:\MIS_DATABASE\DATASHEETS\RESISTORS\RCXXXXL-SER_MAR18.PDF; Crtd /date: VASANTHA/270516; Chkd/date: VASANTHA/270516; Library Ref: RESISTOR; Footprint Ref: RES0402_0-5; MECHANICAL 3D STEP FILE: RES0402_0-5; Library Path: Y:\MIS_DATABASE\Library\ALTIUM_TOOL\SCHEMATICS_PARTS\MS_DISCRETE_Library.schlib; Footprint Path: Y:\MIS_DATABASE\Library\ALTIUM_TOOL\PCB_FOOTPRINTS\Altium_Footprint_Lib.PcbLib
R56 = RESISTOR_Dup2: RES 2.49K 1/16W 1% 0402; Part Reference: R56; Part_type: RESISTORS\FIXED; Mfr_part_number: RC0402FR-072K49L; Mfr_name: YAGEO AMERICA; Mistral Part No: 110016050020-R; Custom_Duty: 15%; Customs_HS_Code: 85332119; Voltage: NA; Project: TMDXCSKCC; Value: 2.49K_1%; PCB Footprint: RES0402_0-5; Library Ref: RESISTOR; Chkd/date: VASANTHA/270516; Crtd /date: VASANTHA/270516; Datasheet: Y:\MIS_DATABASE\DATASHEETS\RESISTORS\RCXXXXL-SER_MAR18.PDF; Temperature: -55°C+155°C; Weight: 0.65mg; Height: 0.40MM; Distributor_part_number: 311-2.49KLRCT-ND; Distributor_name: DIGIKEY; Package: 0402; Wattage: 1/16W; Tolerance: 1%; Footprint Ref: RES0402_0-5; MECHANICAL 3D STEP FILE: RES0402_0-5; Library Path: Y:\MIS_DATABASE\Library\ALTIUM_TOOL\SCHEMATICS_PARTS\MS_DISCRETE_Library.schlib; Footprint Path: Y:\MIS_DATABASE\Library\ALTIUM_TOOL\PCB_FOOTPRINTS\Altium_Footprint_Lib.PcbLib
R57 = RESISTOR_Dup2: RES 2.49K 1/16W 1% 0402; Part Reference: R57; Mistral Part No: 110016050020-R; Mfr_name: YAGEO AMERICA; Mfr_part_number: RC0402FR-072K49L; Part_type: RESISTORS\FIXED; Project: TMDXCSKCC; Voltage: NA; Customs_HS_Code: 85332119; Custom_Duty: 15%; Value: 2.49K_1%; PCB Footprint: RES0402_0-5; Tolerance: 1%; Wattage: 1/16W; Package: 0402; Distributor_name: DIGIKEY; Distributor_part_number: 311-2.49KLRCT-ND; Height: 0.40MM; Weight: 0.65mg; Temperature: -55°C+155°C; Datasheet: Y:\MIS_DATABASE\DATASHEETS\RESISTORS\RCXXXXL-SER_MAR18.PDF; Crtd /date: VASANTHA/270516; Chkd/date: VASANTHA/270516; Library Ref: RESISTOR; Footprint Ref: RES0402_0-5; MECHANICAL 3D STEP FILE: RES0402_0-5; Library Path: Y:\MIS_DATABASE\Library\ALTIUM_TOOL\SCHEMATICS_PARTS\MS_DISCRETE_Library.schlib; Footprint Path: Y:\MIS_DATABASE\Library\ALTIUM_TOOL\PCB_FOOTPRINTS\Altium_Footprint_Lib.PcbLib
R58 = RESISTOR_Dup2: RES 2.49K 1/16W 1% 0402; Part Reference: R58; Part_type: RESISTORS\FIXED; Mfr_part_number: RC0402FR-072K49L; Mfr_name: YAGEO AMERICA; Mistral Part No: 110016050020-R; Custom_Duty: 15%; Customs_HS_Code: 85332119; Voltage: NA; Project: TMDXCSKCC; Value: 2.49K_1%; PCB Footprint: RES0402_0-5; Chkd/date: VASANTHA/270516; Crtd /date: VASANTHA/270516; Datasheet: Y:\MIS_DATABASE\DATASHEETS\RESISTORS\RCXXXXL-SER_MAR18.PDF; Temperature: -55°C+155°C; Weight: 0.65mg; Height: 0.40MM; Distributor_part_number: 311-2.49KLRCT-ND; Distributor_name: DIGIKEY; Package: 0402; Wattage: 1/16W; Tolerance: 1%; Library Ref: RESISTOR; Footprint Ref: RES0402_0-5; MECHANICAL 3D STEP FILE: RES0402_0-5; Library Path: Y:\MIS_DATABASE\Library\ALTIUM_TOOL\SCHEMATICS_PARTS\MS_DISCRETE_Library.schlib; Footprint Path: Y:\MIS_DATABASE\Library\ALTIUM_TOOL\PCB_FOOTPRINTS\Altium_Footprint_Lib.PcbLib
R59 = RESISTOR_Dup2: RES 2.49K 1/16W 1% 0402; Part Reference: R59; Part_type: RESISTORS\FIXED; Mfr_part_number: RC0402FR-072K49L; Mfr_name: YAGEO AMERICA; Mistral Part No: 110016050020-R; Custom_Duty: 15%; Customs_HS_Code: 85332119; Voltage: NA; Project: TMDXCSKCC; Value: 2.49K_1%; PCB Footprint: RES0402_0-5; Chkd/date: VASANTHA/270516; Crtd /date: VASANTHA/270516; Datasheet: Y:\MIS_DATABASE\DATASHEETS\RESISTORS\RCXXXXL-SER_MAR18.PDF; Temperature: -55°C+155°C; Weight: 0.65mg; Height: 0.40MM; Distributor_part_number: 311-2.49KLRCT-ND; Distributor_name: DIGIKEY; Package: 0402; Wattage: 1/16W; Tolerance: 1%; Library Ref: RESISTOR; Footprint Ref: RES0402_0-5; MECHANICAL 3D STEP FILE: RES0402_0-5; Library Path: Y:\MIS_DATABASE\Library\ALTIUM_TOOL\SCHEMATICS_PARTS\MS_DISCRETE_Library.schlib; Footprint Path: Y:\MIS_DATABASE\Library\ALTIUM_TOOL\PCB_FOOTPRINTS\Altium_Footprint_Lib.PcbLib
R60 = RESISTOR_Dup2: RES 2.49K 1/16W 1% 0402; Part Reference: R60; Part_type: RESISTORS\FIXED; Mfr_part_number: RC0402FR-072K49L; Mfr_name: YAGEO AMERICA; Mistral Part No: 110016050020-R; Custom_Duty: 15%; Customs_HS_Code: 85332119; Voltage: NA; Project: TMDXCSKCC; Value: 2.49K_1%; PCB Footprint: RES0402_0-5; Library Ref: RESISTOR; Chkd/date: VASANTHA/270516; Crtd /date: VASANTHA/270516; Datasheet: Y:\MIS_DATABASE\DATASHEETS\RESISTORS\RCXXXXL-SER_MAR18.PDF; Temperature: -55°C+155°C; Weight: 0.65mg; Height: 0.40MM; Distributor_part_number: 311-2.49KLRCT-ND; Distributor_name: DIGIKEY; Package: 0402; Wattage: 1/16W; Tolerance: 1%; Footprint Ref: RES0402_0-5; MECHANICAL 3D STEP FILE: RES0402_0-5; Library Path: Y:\MIS_DATABASE\Library\ALTIUM_TOOL\SCHEMATICS_PARTS\MS_DISCRETE_Library.schlib; Footprint Path: Y:\MIS_DATABASE\Library\ALTIUM_TOOL\PCB_FOOTPRINTS\Altium_Footprint_Lib.PcbLib
R61 = RESISTOR_Dup2: RES 2.49K 1/16W 1% 0402; Part Reference: R61; Part_type: RESISTORS\FIXED; Mfr_part_number: RC0402FR-072K49L; Mfr_name: YAGEO AMERICA; Mistral Part No: 110016050020-R; Custom_Duty: 15%; Customs_HS_Code: 85332119; Voltage: NA; Project: TMDXCSKCC; Value: 2.49K_1%; PCB Footprint: RES0402_0-5; Chkd/date: VASANTHA/270516; Crtd /date: VASANTHA/270516; Datasheet: Y:\MIS_DATABASE\DATASHEETS\RESISTORS\RCXXXXL-SER_MAR18.PDF; Temperature: -55°C+155°C; Weight: 0.65mg; Height: 0.40MM; Distributor_part_number: 311-2.49KLRCT-ND; Distributor_name: DIGIKEY; Package: 0402; Wattage: 1/16W; Tolerance: 1%; Library Ref: RESISTOR; Footprint Ref: RES0402_0-5; MECHANICAL 3D STEP FILE: RES0402_0-5; Library Path: Y:\MIS_DATABASE\Library\ALTIUM_TOOL\SCHEMATICS_PARTS\MS_DISCRETE_Library.schlib; Footprint Path: Y:\MIS_DATABASE\Library\ALTIUM_TOOL\PCB_FOOTPRINTS\Altium_Footprint_Lib.PcbLib
R312 = RESISTOR_Dup2: RES 22E 1/16W 1% 0402; Part Reference: R312; Mistral Part No: 110009090004-R; Mfr_name: YAGEO AMERICA; Mfr_part_number: RC0402FR-0722RL; Part_type: RESISTORS\FIXED; Cust_part_number: 4700-80047E; Project: VMEFMCD; Voltage: NA; Customs_HS_Code: 85332119; Custom_Duty: 15%; SIGNAL_MODEL: RESISTOR_RES0402_22E_1%_22E_1%; Value: 22E_1%; PCB Footprint: RES0402_0-5; Footprint Path: Y:\MIS_DATABASE\Library\ALTIUM_TOOL\PCB_FOOTPRINTS\Altium_Footprint_Lib.PcbLib; Library Path: Y:\MIS_DATABASE\Library\ALTIUM_TOOL\SCHEMATICS_PARTS\MS_DISCRETE_Library.schlib; MECHANICAL 3D STEP FILE: RES0402_0-5; Footprint Ref: RES0402_0-5; Library Ref: RESISTOR; Tolerance: 1%; Wattage: 1/16W; Package: 0402; Distributor_name: DIGIKEY; Distributor_part_number: 311-22.0LRCT-ND; Height: 0.40MM; Weight: 0.65mg; Temperature: -55°C+155°C; Datasheet: Y:\MIS_DATABASE\DATASHEETS\RESISTORS\RCXXXXL-SER_MAR18.PDF; Crtd /date: MAZHAR/090909; Chkd/date: SUHAS/290910
R313 = RESISTOR_Dup2: RES 2.49K 1/16W 1% 0402; Part Reference: R313; Part_type: RESISTORS\FIXED; Mfr_part_number: RC0402FR-072K49L; Mfr_name: YAGEO AMERICA; Mistral Part No: 110016050020-R; Custom_Duty: 15%; Customs_HS_Code: 85332119; Voltage: NA; Project: TMDXCSKCC; Value: 2.49K_1%; PCB Footprint: RES0402_0-5; Chkd/date: VASANTHA/270516; Crtd /date: VASANTHA/270516; Datasheet: Y:\MIS_DATABASE\DATASHEETS\RESISTORS\RCXXXXL-SER_MAR18.PDF; Temperature: -55°C+155°C; Weight: 0.65mg; Height: 0.40MM; Distributor_part_number: 311-2.49KLRCT-ND; Distributor_name: DIGIKEY; Package: 0402; Wattage: 1/16W; Tolerance: 1%; Library Ref: RESISTOR; Footprint Ref: RES0402_0-5; MECHANICAL 3D STEP FILE: RES0402_0-5; Library Path: Y:\MIS_DATABASE\Library\ALTIUM_TOOL\SCHEMATICS_PARTS\MS_DISCRETE_Library.schlib; Footprint Path: Y:\MIS_DATABASE\Library\ALTIUM_TOOL\PCB_FOOTPRINTS\Altium_Footprint_Lib.PcbLib
R314 = RESISTOR_Dup2: RES 10K 1/16W 5% 0402; Part Reference: R314; Part_type: RESISTORS\FIXED; Mfr_part_number: RC0402JR-0710KL; Mfr_name: YAGEO AMERICA; Mistral Part No: 110011060021-R; Custom_Duty: 15%; Customs_HS_Code: 85332119; Voltage: NA; Project: HSE; Value: 10K; PCB Footprint: RES0402_0-5; MECHANICAL 3D STEP FILE: RES0402_0-5; Chkd/date: VASANTHA/061216; Crtd /date: MAZHAR/230805; Datasheet: Y:\MIS_DATABASE\DATASHEETS\RESISTORS\RCXXXXL-SER_MAR18.PDF; Temperature: -55°C+155°C; Weight: 0.65mg; Height: 0.40MM; Distributor_part_number: 311-10KJRCT-ND; Distributor_name: DIGIKEY; Package: 0402; Wattage: 1/16W; Tolerance: 5%; Library Ref: RESISTOR; Footprint Ref: RES0402_0-5; Library Path: Y:\MIS_DATABASE\Library\ALTIUM_TOOL\SCHEMATICS_PARTS\MS_DISCRETE_Library.schlib; Footprint Path: Y:\MIS_DATABASE\Library\ALTIUM_TOOL\PCB_FOOTPRINTS\Altium_Footprint_Lib.PcbLib
R315 = RESISTOR_Dup2: RES 10K 1/16W 5% 0402; Part Reference: R315; Part_type: RESISTORS\FIXED; Mfr_part_number: RC0402JR-0710KL; Mfr_name: YAGEO AMERICA; Mistral Part No: 110011060021-R; Custom_Duty: 15%; Customs_HS_Code: 85332119; Voltage: NA; Project: HSE; Value: 10K; PCB Footprint: RES0402_0-5; MECHANICAL 3D STEP FILE: RES0402_0-5; Chkd/date: VASANTHA/061216; Crtd /date: MAZHAR/230805; Datasheet: Y:\MIS_DATABASE\DATASHEETS\RESISTORS\RCXXXXL-SER_MAR18.PDF; Temperature: -55°C+155°C; Weight: 0.65mg; Height: 0.40MM; Distributor_part_number: 311-10KJRCT-ND; Distributor_name: DIGIKEY; Package: 0402; Wattage: 1/16W; Tolerance: 5%; Library Ref: RESISTOR; Footprint Ref: RES0402_0-5; Library Path: Y:\MIS_DATABASE\Library\ALTIUM_TOOL\SCHEMATICS_PARTS\MS_DISCRETE_Library.schlib; Footprint Path: Y:\MIS_DATABASE\Library\ALTIUM_TOOL\PCB_FOOTPRINTS\Altium_Footprint_Lib.PcbLib
R320 = RESISTOR_Dup2: RES 10K 1/16W 5% 0402; Part Reference: R320; Mistral Part No: 110011060021-R; Mfr_name: YAGEO AMERICA; Mfr_part_number: RC0402JR-0710KL; Part_type: RESISTORS\FIXED; Project: HSE; Voltage: NA; Customs_HS_Code: 85332119; Custom_Duty: 15%; Value: 10K; PCB Footprint: RES0402_0-5; Tolerance: 5%; Wattage: 1/16W; Package: 0402; Distributor_name: DIGIKEY; Distributor_part_number: 311-10KJRCT-ND; Height: 0.40MM; Weight: 0.65mg; Temperature: -55°C+155°C; Datasheet: Y:\MIS_DATABASE\DATASHEETS\RESISTORS\RCXXXXL-SER_MAR18.PDF; Crtd /date: MAZHAR/230805; Chkd/date: VASANTHA/061216; MECHANICAL 3D STEP FILE: RES0402_0-5; Library Ref: RESISTOR; Footprint Ref: RES0402_0-5; Library Path: Y:\MIS_DATABASE\Library\ALTIUM_TOOL\SCHEMATICS_PARTS\MS_DISCRETE_Library.schlib; Footprint Path: Y:\MIS_DATABASE\Library\ALTIUM_TOOL\PCB_FOOTPRINTS\Altium_Footprint_Lib.PcbLib
R321 = RESISTOR_Dup2: RES 10K 1/16W 5% 0402; Part Reference: R321; Part_type: RESISTORS\FIXED; Mfr_part_number: RC0402JR-0710KL; Mfr_name: YAGEO AMERICA; Mistral Part No: 110011060021-R; Custom_Duty: 15%; Customs_HS_Code: 85332119; Voltage: NA; Project: HSE; Value: 10K; PCB Footprint: RES0402_0-5; Footprint Path: Y:\MIS_DATABASE\Library\ALTIUM_TOOL\PCB_FOOTPRINTS\Altium_Footprint_Lib.PcbLib; Library Path: Y:\MIS_DATABASE\Library\ALTIUM_TOOL\SCHEMATICS_PARTS\MS_DISCRETE_Library.schlib; Footprint Ref: RES0402_0-5; Library Ref: RESISTOR; MECHANICAL 3D STEP FILE: RES0402_0-5; Chkd/date: VASANTHA/061216; Crtd /date: MAZHAR/230805; Datasheet: Y:\MIS_DATABASE\DATASHEETS\RESISTORS\RCXXXXL-SER_MAR18.PDF; Temperature: -55°C+155°C; Weight: 0.65mg; Height: 0.40MM; Distributor_part_number: 311-10KJRCT-ND; Distributor_name: DIGIKEY; Package: 0402; Wattage: 1/16W; Tolerance: 5%
R322 = RESISTOR_Dup2: RES 10K 1/16W 5% 0402; Part Reference: R322; Mistral Part No: 110011060021-R; Mfr_name: YAGEO AMERICA; Mfr_part_number: RC0402JR-0710KL; Part_type: RESISTORS\FIXED; Project: HSE; Voltage: NA; Customs_HS_Code: 85332119; Custom_Duty: 15%; Value: 10K; PCB Footprint: RES0402_0-5; MECHANICAL 3D STEP FILE: RES0402_0-5; Tolerance: 5%; Wattage: 1/16W; Package: 0402; Distributor_name: DIGIKEY; Distributor_part_number: 311-10KJRCT-ND; Height: 0.40MM; Weight: 0.65mg; Temperature: -55°C+155°C; Datasheet: Y:\MIS_DATABASE\DATASHEETS\RESISTORS\RCXXXXL-SER_MAR18.PDF; Crtd /date: MAZHAR/230805; Chkd/date: VASANTHA/061216; Library Ref: RESISTOR; Footprint Ref: RES0402_0-5; Library Path: Y:\MIS_DATABASE\Library\ALTIUM_TOOL\SCHEMATICS_PARTS\MS_DISCRETE_Library.schlib; Footprint Path: Y:\MIS_DATABASE\Library\ALTIUM_TOOL\PCB_FOOTPRINTS\Altium_Footprint_Lib.PcbLib
R323 = RESISTOR_Dup2: RES 5.76K 1/10W 1% 0402; Part Reference: R323; Part_type: RESISTORS\FIXED; Mfr_part_number: ERJ-2RKF5761X; Mfr_name: PANASONIC-ECG; Mistral Part No: 110009030945-R; Voltage: NA; Custom_Duty: 15%; Customs_HS_Code: 85332119; Project: CPB; Value: 5.76K_1%; PCB Footprint: RES0402_0-5; MECHANICAL 3D STEP FILE: RES0402_0-5; Temperature: -55°C+155°C; Weight: 0.8mg; Footprint Ref: RES0402_0-5; Chkd/date: MAZHAR/150709; Crtd /date: USMAN/220808; Datasheet: Y:\MIS_DATABASE\DATASHEETS\RESISTORS\PAN-ERJSER_NOV17.PDF; Height: 0.40MM; Distributor_part_number: P5.76KLCT-ND; Distributor_name: DIGIKEY; Package: 0402; Wattage: 1/10W; Tolerance: 1%; Library Ref: RESISTOR; Library Path: Y:\MIS_DATABASE\Library\ALTIUM_TOOL\SCHEMATICS_PARTS\MS_DISCRETE_Library.schlib; Footprint Path: Y:\MIS_DATABASE\Library\ALTIUM_TOOL\PCB_FOOTPRINTS\Altium_Footprint_Lib.PcbLib
R324 = RESISTOR_Dup2: RES 5.76K 1/10W 1% 0402; Part Reference: R324; Mistral Part No: 110009030945-R; Mfr_name: PANASONIC-ECG; Mfr_part_number: ERJ-2RKF5761X; Part_type: RESISTORS\FIXED; Project: CPB; Voltage: NA; Customs_HS_Code: 85332119; Custom_Duty: 15%; Value: 5.76K_1%; PCB Footprint: RES0402_0-5; Tolerance: 1%; Wattage: 1/10W; Package: 0402; Distributor_name: DIGIKEY; Distributor_part_number: P5.76KLCT-ND; Height: 0.40MM; Weight: 0.8mg; Temperature: -55°C+155°C; Datasheet: Y:\MIS_DATABASE\DATASHEETS\RESISTORS\PAN-ERJSER_NOV17.PDF; Crtd /date: USMAN/220808; Chkd/date: MAZHAR/150709; MECHANICAL 3D STEP FILE: RES0402_0-5; Library Ref: RESISTOR; Footprint Ref: RES0402_0-5; Library Path: Y:\MIS_DATABASE\Library\ALTIUM_TOOL\SCHEMATICS_PARTS\MS_DISCRETE_Library.schlib; Footprint Path: Y:\MIS_DATABASE\Library\ALTIUM_TOOL\PCB_FOOTPRINTS\Altium_Footprint_Lib.PcbLib
R325 = RESISTOR_Dup2: RES 5.76K 1/10W 1% 0402; Part Reference: R325; Part_type: RESISTORS\FIXED; Mfr_part_number: ERJ-2RKF5761X; Mfr_name: PANASONIC-ECG; Mistral Part No: 110009030945-R; Custom_Duty: 15%; Customs_HS_Code: 85332119; Voltage: NA; Project: CPB; Value: 5.76K_1%; PCB Footprint: RES0402_0-5; Footprint Path: Y:\MIS_DATABASE\Library\ALTIUM_TOOL\PCB_FOOTPRINTS\Altium_Footprint_Lib.PcbLib; Library Path: Y:\MIS_DATABASE\Library\ALTIUM_TOOL\SCHEMATICS_PARTS\MS_DISCRETE_Library.schlib; Footprint Ref: RES0402_0-5; Library Ref: RESISTOR; Chkd/date: MAZHAR/150709; Crtd /date: USMAN/220808; Datasheet: Y:\MIS_DATABASE\DATASHEETS\RESISTORS\PAN-ERJSER_NOV17.PDF; Temperature: -55°C+155°C; Weight: 0.8mg; Height: 0.40MM; Distributor_part_number: P5.76KLCT-ND; Distributor_name: DIGIKEY; Package: 0402; Wattage: 1/10W; Tolerance: 1%; MECHANICAL 3D STEP FILE: RES0402_0-5
R329 = RESISTOR_Dup2: RES 2.2K 1/20W 5% 0201; Part Reference: R329; Mistral Part No: 110009030427-R; Mfr_name: YAGEO AMERICA; Mfr_part_number: RC0201JR-072K2L; Part_type: RESISTORS\FIXED; Project: GOLDEN-I LITE; Voltage: NA; Customs_HS_Code: 85332119; Custom_Duty: 15%; Value: 2.2K; PCB Footprint: RES0201_0-5; Footprint Ref: RES0201_0-5; Tolerance: 5%; Wattage: 1/20W; Package: 0201; Distributor_name: DIGIKEY; Distributor_part_number: 311-2.2KNCT-ND; Library Ref: RESISTOR; Height: 0.26MM; Weight: 0.17mg; Temperature: -55°C+125°C; Datasheet: Y:\MIS_DATABASE\DATASHEETS\RESISTORS\RCXXXXL-SER_MAR18.PDF; Crtd /date: MANIRAJA/050517; Chkd/date: MANIRAJA/050517; MECHANICAL 3D STEP FILE: RES0201_0-5; Library Path: Y:\MIS_DATABASE\Library\ALTIUM_TOOL\SCHEMATICS_PARTS\MS_DISCRETE_Library.schlib; Footprint Path: Y:\MIS_DATABASE\Library\ALTIUM_TOOL\PCB_FOOTPRINTS\Altium_Footprint_Lib.PcbLib
R343 = RESISTOR_Dup2: RES 11K 1/16W 1% 0402; Part Reference: R343; Part_type: RESISTORS\FIXED; Mfr_part_number: RC0402FR-0711KL; Mfr_name: YAGEO AMERICA; Mistral Part No: 110015110012-R; Custom_Duty: 15%; Customs_HS_Code: 85332119; Voltage: NA; Project: TI_VLAN_SWITCH; Value: 11K_1%; PCB Footprint: RES0402_0-5; Footprint Path: Y:\MIS_DATABASE\Library\ALTIUM_TOOL\PCB_FOOTPRINTS\Altium_Footprint_Lib.PcbLib; Library Path: Y:\MIS_DATABASE\Library\ALTIUM_TOOL\SCHEMATICS_PARTS\MS_DISCRETE_Library.schlib; Footprint Ref: RES0402_0-5; Library Ref: RESISTOR; MECHANICAL 3D STEP FILE: RES0402_0-5; Chkd/date: VASANTHA/251115; Crtd /date: VASANTHA/251115; Datasheet: Y:\MIS_DATABASE\DATASHEETS\RESISTORS\RCXXXXL-SER_MAR18.PDF; Temperature: -55°C+155°C; Weight: 0.65mg; Height: 0.40MM; Distributor_part_number: 311-11.0KLRCT-ND; Distributor_name: DIGIKEY; Package: 0402; Wattage: 1/16W; Tolerance: 1%
R345 = RESISTOR_Dup2: RES 220E 1/16W 5% 0402; Part Reference: R345; Mistral Part No: 110020120013-R; Mfr_name: YAGEO AMERICA; Mfr_part_number: RC0402JR-07220RL; Part_type: RESISTORS\FIXED; Project: TI_AM243x LP EVM; Voltage: NA; Customs_HS_Code: 85332119; Custom_Duty: 15%; Value: 220E; PCB Footprint: RES0402_0-5; Footprint Ref: RES0402_0-5; Tolerance: 5%; Wattage: 1/16W; Package: 0402; Distributor_name: DIGIKEY; Distributor_part_number: 311-220JRCT-ND; Library Ref: RESISTOR; Height: 0.40MM; Weight: 0.65mg; Temperature: -55°C+155°C; Datasheet: Y:\MIS_DATABASE\DATASHEETS\RESISTORS\RCXXXXL-SER_MAR18.PDF; Crtd /date: MANIRAJA/091220; Chkd/date: ALVY/091220; MECHANICAL 3D STEP FILE: RES0402_0-5; Library Path: Y:\MIS_DATABASE\Library\ALTIUM_TOOL\SCHEMATICS_PARTS\MS_DISCRETE_Library.schlib; Footprint Path: Y:\MIS_DATABASE\Library\ALTIUM_TOOL\PCB_FOOTPRINTS\Altium_Footprint_Lib.PcbLib
R346 = RESISTOR_Dup2: RES 220E 1/16W 5% 0402; Part Reference: R346; Mistral Part No: 110020120013-R; Mfr_name: YAGEO AMERICA; Mfr_part_number: RC0402JR-07220RL; Part_type: RESISTORS\FIXED; Project: TI_AM243x LP EVM; Voltage: NA; Customs_HS_Code: 85332119; Custom_Duty: 15%; Value: 220E; PCB Footprint: RES0402_0-5; Footprint Path: Y:\MIS_DATABASE\Library\ALTIUM_TOOL\PCB_FOOTPRINTS\Altium_Footprint_Lib.PcbLib; Library Path: Y:\MIS_DATABASE\Library\ALTIUM_TOOL\SCHEMATICS_PARTS\MS_DISCRETE_Library.schlib; Footprint Ref: RES0402_0-5; Library Ref: RESISTOR; Tolerance: 5%; Wattage: 1/16W; Package: 0402; Distributor_name: DIGIKEY; Distributor_part_number: 311-220JRCT-ND; Height: 0.40MM; Weight: 0.65mg; Temperature: -55°C+155°C; Datasheet: Y:\MIS_DATABASE\DATASHEETS\RESISTORS\RCXXXXL-SER_MAR18.PDF; Crtd /date: MANIRAJA/091220; Chkd/date: ALVY/091220; MECHANICAL 3D STEP FILE: RES0402_0-5
R347 = RESISTOR_Dup2: RES 1M 1/8W 1% 0805; Part Reference: R347; Part_type: RESISTORS\FIXED; Mfr_part_number: ERJ-6ENF1004V; Mfr_name: PANASONIC-ECG; Mistral Part No: 110014100002-R; Custom_Duty: 15%; Customs_HS_Code: 85332119; Voltage: NA; Project: HUMANWARE_PHOENIX; Value: 1M_1%; Footprint Path: Y:\MIS_DATABASE\Library\ALTIUM_TOOL\PCB_FOOTPRINTS\Altium_Footprint_Lib.PcbLib; Library Path: Y:\MIS_DATABASE\Library\ALTIUM_TOOL\SCHEMATICS_PARTS\MS_DISCRETE_Library.schlib; MECHANICAL 3D STEP FILE: RES0805_0-75; Chkd/date: VASANTHA/150514; Crtd /date: BALACHANDAR/150514; Datasheet: Y:\MIS_DATABASE\DATASHEETS\RESISTORS\PAN-ERJSER_NOV17.PDF; Temperature: -55°C+155°C; Weight: 4mg; Height: 0.70MM; Library Ref: RESISTOR; Distributor_part_number: P1.00MCCT-ND; Distributor_name: DIGIKEY; Package: 0805; Wattage: 1/8W; Tolerance: 1%; Footprint Ref: RES0805_0-75; PCB Footprint: RES0805_0-75
TP94 = TESTPOINT_Dup1: TESTPOINT CIR 30 SMD; Part Reference: TP94; Mistral Part No: 130009030930; Mfr_name: LOCAL; Custom_Duty: NA; Project: BT MODULE_CSRBC04; Value: TP30_SMD; PCB Footprint: TP30_SMD; Customs_HS_Code: NA; Mfr_part_number: TP30_SMD; Part_type: TESTPOINT; Package: SMD; Distributor_name: NA; Distributor_part_number: NA; Height: NA; Crtd /date: MAZHAR/171006; Chkd/date: SHREESHAIL/171006; Tolerance: NA; Voltage: NA; Wattage: NA; Weight: NA; Temperature: NA; Datasheet: NA; MECHANICAL 3D STEP FILE: NA; Library Path: Y:\MIS_DATABASE\Library\ALTIUM_TOOL\SCHEMATICS_PARTS\MS_DISCRETE_Library.schlib; Footprint Path: Y:\MIS_DATABASE\Library\ALTIUM_TOOL\PCB_FOOTPRINTS\Altium_Footprint_Lib.PcbLib; Library Ref: TESTPOINT; Footprint Ref: TP30_SMD; RoHS: NA
TP95 = TESTPOINT_Dup1: TESTPOINT CIR 30 SMD; Part Reference: TP95; Mistral Part No: 130009030930; Mfr_name: LOCAL; Custom_Duty: NA; Project: BT MODULE_CSRBC04; Value: TP30_SMD; PCB Footprint: TP30_SMD; Customs_HS_Code: NA; RoHS: NA; Footprint Ref: TP30_SMD; Library Ref: TESTPOINT; Footprint Path: Y:\MIS_DATABASE\Library\ALTIUM_TOOL\PCB_FOOTPRINTS\Altium_Footprint_Lib.PcbLib; Library Path: Y:\MIS_DATABASE\Library\ALTIUM_TOOL\SCHEMATICS_PARTS\MS_DISCRETE_Library.schlib; MECHANICAL 3D STEP FILE: NA; Datasheet: NA; Temperature: NA; Weight: NA; Wattage: NA; Voltage: NA; Tolerance: NA; Mfr_part_number: TP30_SMD; Part_type: TESTPOINT; Package: SMD; Distributor_name: NA; Distributor_part_number: NA; Height: NA; Crtd /date: MAZHAR/171006; Chkd/date: SHREESHAIL/171006
U77 = DP83867ERGZT_VQFN48: IC SMALL FORM FACTOR 10/100/1000 Mb/s ETHERNET PHY LAYER TRANSCEIVER VQFN48; Part Reference: U77; Mistral Part No: 143015110004-R; Mfr_name: TEXAS INSTRUMENTS; Part_type: ICS\TELECOM\TRANSCEIVER; Project: TI_VLAN_SWITCH; Tolerance: NA; Customs_HS_Code: 85423100; Custom_Duty: 15%; Value: DP83867ERGZT; Mfr_part_number: DP83867ERGZT; Voltage: NA; Wattage: NA; Package: VQFN48; Distributor_name: DIGIKEY; Distributor_part_number: 296-43254-1-ND; Library Ref: DP83867ERGZT_VQFN48; Height: 1.00MM; Weight: NA; Temperature: -40°C+105°C; Datasheet: Y:\MIS_DATABASE\DATASHEETS\ICS\DIGITAL\BUSTRANSCEIVER\DP83867.PDF; Crtd /date: VASANTHA/251115; Chkd/date: VASANTHA/251115; PCB Footprint: VQFN48_19-68_285X285
Y4 = CRY: CRY 25.000MHz 18pF SMD; Part Reference: Y4; Mistral Part No: 130021050010-R; Mfr_name: ECS INC; Part_type: CRYSTAL; Project: J7ES_SKEVM; Tolerance: NA; Customs_HS_Code: 85439000; Custom_Duty: 24%; Value: 25.000MHz; PCB Footprint: XTAL_ECX-64A_240X150_SMD_1-1; Footprint Ref: XTAL_ECX-64A_240X150_SMD_1-1; Voltage: NA; Wattage: NA; Package: SMD; Distributor_name: DIGIKEY; Distributor_part_number: XC2099CT-ND; Library Ref: CRY; Height: 1.10MM; Weight: 60mg; Temperature: -40°C+85°C; Datasheet: Y:\MIS_DATABASE\DATASHEETS\MISC\CRY_OSC\ECX-64A.PDF; Crtd /date: MANIRAJA/260521; Chkd/date: ALVY/260521; MECHANICAL 3D STEP FILE: XTAL_ECX-64A_240X150_SMD_1-1; Library Path: Y:\MIS_DATABASE\Library\ALTIUM_TOOL\SCHEMATICS_PARTS\MS_DISCRETE_Library.schlib; Footprint Path: Y:\MIS_DATABASE\Library\ALTIUM_TOOL\PCB_FOOTPRINTS\Altium_Footprint_Lib.PcbLib